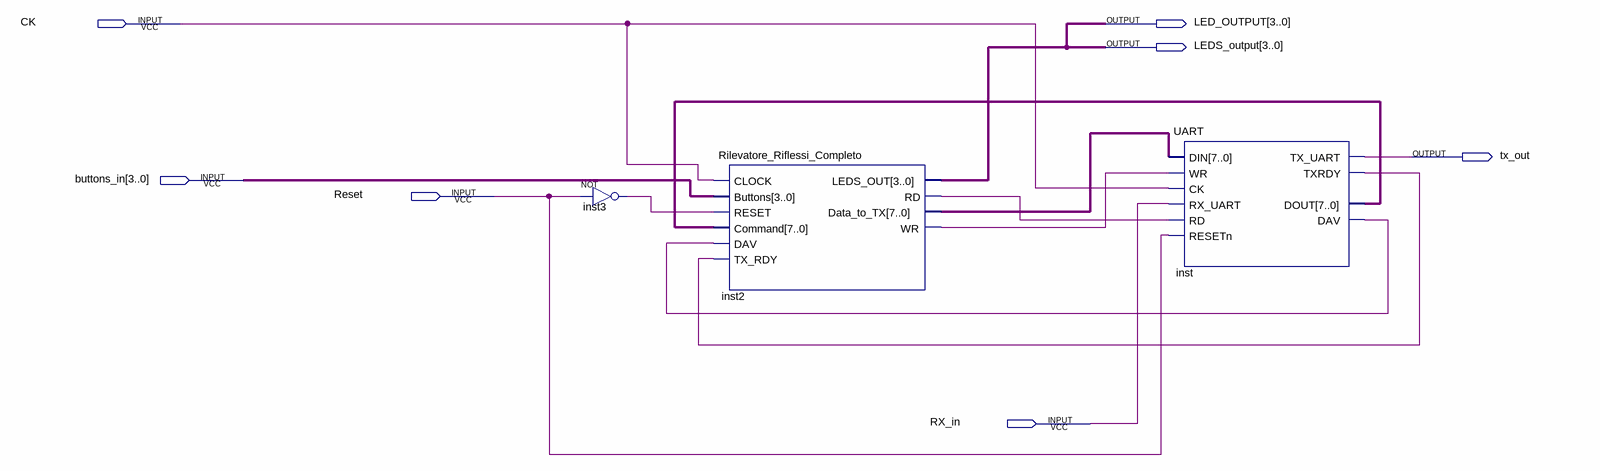
[diagram p0: schematic sheet]
// Quartus schematic UartProgetto_comp.bdf as structural Verilog: 3 symbols, 7 pins
module UartProgetto_comp (
  input  CK,
  input  [3:0] buttons_in,
  input  Reset,
  input  RX_in,
  output [3:0] LED_OUTPUT,
  output [3:0] LEDS_output,
  output tx_out
);

  wire inst2_rd, inst2_wr, inst3_out, inst_dav, inst_txrdy;
  wire [7:0] inst2_data_to_tx, inst_dout;

  not inst3 (inst3_out, Reset);
  Rilevatore_Riflessi_Completo inst2 (
    .CLOCK(CK), .Buttons(buttons_in), .RESET(inst3_out), .Command(inst_dout), .DAV(inst_dav),
    .TX_RDY(inst_txrdy), .LEDS_OUT(LED_OUTPUT), .RD(inst2_rd), .Data_to_TX(inst2_data_to_tx), .WR(inst2_wr));
  UART inst (
    .DIN(inst2_data_to_tx), .WR(inst2_wr), .CK(CK), .RX_UART(RX_in), .RD(inst2_rd), .RESETn(Reset),
    .TX_UART(tx_out), .TXRDY(inst_txrdy), .DOUT(inst_dout), .DAV(inst_dav));

  assign LEDS_output = LED_OUTPUT;
endmodule
